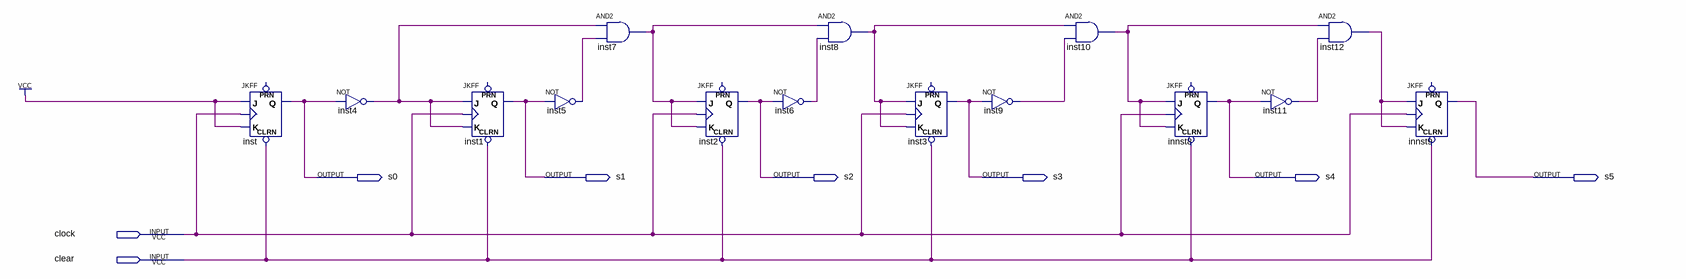
[diagram p0: schematic sheet]
// Quartus schematic counter.bdf as structural Verilog: 15 symbols, 8 pins
module counter (
  input  clock,
  input  clear,
  output s0,
  output s1,
  output s2,
  output s3,
  output s4,
  output s5
);

  wire inst4_out, inst5_out, inst6_out, inst7_out, inst8_out, inst9_out, inst10_out, inst11_out, inst12_out;

  JKFF inst (.CLRN(clear), .K(1'b1), .J(1'b1), .CLK(clock), .Q(s0));  // open: PRN
  not inst4 (inst4_out, s0);
  JKFF inst1 (.CLRN(clear), .K(inst4_out), .J(inst4_out), .CLK(clock), .Q(s1));  // open: PRN
  not inst5 (inst5_out, s1);
  and inst7 (inst7_out, inst4_out, inst5_out);
  JKFF inst2 (.CLRN(clear), .K(inst7_out), .J(inst7_out), .CLK(clock), .Q(s2));  // open: PRN
  not inst6 (inst6_out, s2);
  and inst8 (inst8_out, inst7_out, inst6_out);
  JKFF inst3 (.CLRN(clear), .K(inst8_out), .J(inst8_out), .CLK(clock), .Q(s3));  // open: PRN
  not inst9 (inst9_out, s3);
  and inst10 (inst10_out, inst8_out, inst9_out);
  JKFF innst8 (.CLRN(clear), .K(inst10_out), .J(inst10_out), .CLK(clock), .Q(s4));  // open: PRN
  not inst11 (inst11_out, s4);
  and inst12 (inst12_out, inst10_out, inst11_out);
  JKFF innst9 (.CLRN(clear), .K(inst12_out), .J(inst12_out), .CLK(clock), .Q(s5));  // open: PRN
endmodule
